# Altium schematic sheet 13.LIGHT.SchDoc: LIGHT SENSOR
size A; SheetNumber: 13; SheetTotal: 16
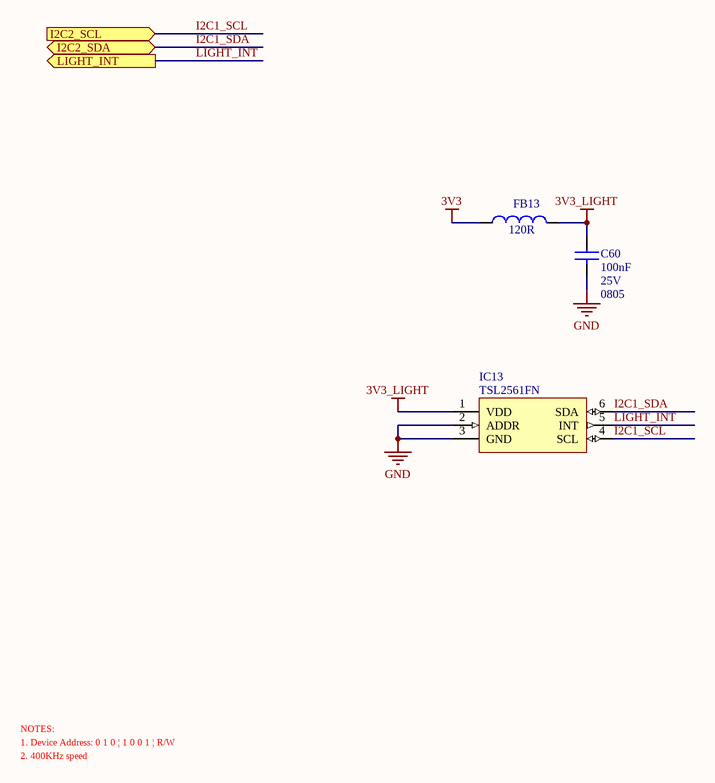
[diagram p0: 13.LIGHT.SchDoc]

## Parts
C60  Capacitance: 100nF  Voltage - Rated: 25V  Package / Case: 0805  [CAPC2012X100N_EIA0805]  (hidden comment: CAP_NP)
FB13  Impedance: 120R  [FILC2012X100N_EIA0805]  (hidden comment: BEAD)
IC13  Manufacturer Part Number: TSL2561FN  [DFN-6]  (hidden comment: TSL256x)

## Ports
I2C2_SCL (in), I2C2_SDA (bidir), LIGHT_INT (out)

## Nets
3V3: FB13.1
3V3_LIGHT: C60.1 FB13.2 IC13.1(VDD)
GND: C60.2 IC13.2(ADDR) IC13.3(GND)
I2C1_SCL: IC13.4(SCL) ; port I2C2_SCL
I2C1_SDA: IC13.6(SDA) ; port I2C2_SDA
LIGHT_INT: IC13.5(INT) ; port LIGHT_INT

## Notes on the sheet
- NOTES:
- 1. Device Address: 0 1 0 | 1 0 0 1 | R/W
- 2. 400KHz speed

## Library data of the parts
C60 = SCAP00300093: CAP CER 0.1UF 25V X7R 0805; Manufacturer: Samsung Electro-Mechanics America, Inc.; Manufacturer Part Number: CL21B104KACNNNC; Value: 100nF; Tolerance: ±10%; Type: Multi Layer Ceramic Capacitor  (MLCC); Cost x1 ($): 0.10000; Cost x10 ($): 0.03300; Cost x100 ($): 0.01470; Cost x1000 ($): 0.00825; Distrubutor: Digikey; Lead Time: 11 Weeks; Part Number: SCAP00300093; Temperature Coefficient: X7R; Operating Temperature: -55°C ~ 125°C; Mounting Type: Surface Mount, MLCC; Size / Dimension: 0.079" L x 0.049" W (2.00mm x 1.25mm); Category: Capacitors; Family: Ceramic Capacitors; Distributor Part Number: 1276-1099-1-ND; Distributor Link: http://www.digikey.com/product-detail/en/samsung-electro-mechanics-america-inc/CL21B104KACNNNC/1276-1099-1-ND/3889185; ROHS: YES; Moisture Sensitivity Level (MSL): 1 (Unlimited); Quantity: 50
FB13 = SFIL00005: FERRITE CHIP POWER 120 OHM SMD; Manufacturer: Laird-Signal Integrity Products; Manufacturer Part Number: HI0805O121R-10; Type: Differential Mode - Single; Current Rating: 3.5A; DC Resistance (DCR): 20 mOhm Max; Cost x10 ($): 0.08700; Cost x100 ($): 0.05230; Cost x1000 ($): 0.03010; Distrubutor: Digikey; Cost x1 ($): 0.10000; Part Number: SFIL00005; Package / Case: 0805 (2012 Metric); Value: BEAD; Category: Filters; Family: Ferrite Beads and Chips; Distributor Part Number: 240-2393-1-ND; ROHS: YES; Datasheet Link: http://www.digikey.com/product-detail/en/HI0805O121R-10/240-2393-1-ND/806753; Quantity: 50
IC13 = SSEN00013: IC LIGHT TO DGTL CONV 6-DFN; Manufacturer: AMS-TAOS USA Inc.; Value: TSL2561FN; Voltage: 2.7 V ~ 3.6 V; Output Type: I²C; Cost x10($): 1.94700; Cost x100 ($): 1.29800; Cost x1000 ($): 1.00595; Distrubutor: DigiKey; Cost x1 ($): 2.40000; Part Number: SSEN00013; Operating Temperature: -30°C ~ 70°C; Category: Sensors, Transducers; Family: Optical Sensors - Ambient Light, IR, UV Sensors; Package / Case: 6-WDFN; Distributor Part Number: TSL2561-FNCT-ND; ROHS: YES; Distributor Link: http://www.digikey.com/product-detail/en/ams-taos-usa-inc/TSL2561FN/TSL2561-FNCT-ND/3095298; Quantity: 0